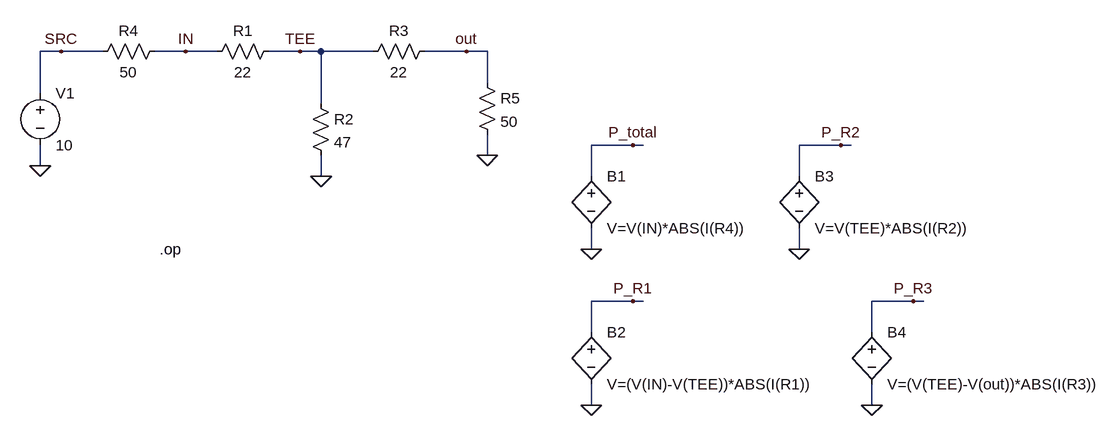
[diagram p0: schematic atten.asc]
atten.asc, the LTspice schematic file:
Version 4
SHEET 1 1524 692
WIRE -112 128 -144 128
WIRE -48 128 -112 128
WIRE 80 128 32 128
WIRE 128 128 80 128
WIRE 256 128 208 128
WIRE 288 128 256 128
WIRE 368 128 288 128
WIRE 512 128 448 128
WIRE 544 128 512 128
WIRE 544 176 544 128
WIRE -144 192 -144 128
WIRE 288 208 288 128
WIRE 768 272 704 272
WIRE 784 272 768 272
WIRE 1088 272 1024 272
WIRE 1104 272 1088 272
WIRE 544 288 544 256
WIRE -144 304 -144 272
WIRE 288 320 288 288
WIRE 704 320 704 272
WIRE 1024 320 1024 272
WIRE 704 432 704 400
WIRE 1024 432 1024 400
WIRE 768 512 704 512
WIRE 784 512 768 512
WIRE 1200 512 1136 512
WIRE 1216 512 1200 512
WIRE 704 560 704 512
WIRE 1136 560 1136 512
WIRE 704 672 704 640
WIRE 1136 672 1136 640
FLAG 256 128 TEE
FLAG 288 320 0
FLAG -144 304 0
FLAG 80 128 IN
FLAG -112 128 SRC
FLAG 544 288 0
FLAG 512 128 out
FLAG 704 432 0
FLAG 768 272 P_total
FLAG 704 672 0
FLAG 768 512 P_R1
FLAG 1024 432 0
FLAG 1088 272 P_R2
FLAG 1136 672 0
FLAG 1200 512 P_R3
SYMBOL res 224 112 R90
WINDOW 0 0 56 VBottom 2
WINDOW 3 32 56 VTop 2
SYMATTR InstName R1
SYMATTR Value 22
SYMBOL res 272 192 R0
SYMATTR InstName R2
SYMATTR Value 47
SYMBOL res 464 112 R90
WINDOW 0 0 56 VBottom 2
WINDOW 3 32 56 VTop 2
SYMATTR InstName R3
SYMATTR Value 22
SYMBOL voltage -144 176 R0
WINDOW 123 0 0 Left 0
WINDOW 39 0 0 Left 0
SYMATTR InstName V1
SYMATTR Value 10
SYMBOL res 48 112 R90
WINDOW 0 0 56 VBottom 2
WINDOW 3 32 56 VTop 2
SYMATTR InstName R4
SYMATTR Value 50
SYMBOL res 528 160 R0
SYMATTR InstName R5
SYMATTR Value 50
SYMBOL bv 704 304 R0
SYMATTR InstName B1
SYMATTR Value V=V(IN)*ABS(I(R4))
SYMBOL bv 704 544 R0
SYMATTR InstName B2
SYMATTR Value V=(V(IN)-V(TEE))*ABS(I(R1))
SYMBOL bv 1024 304 R0
SYMATTR InstName B3
SYMATTR Value V=V(TEE)*ABS(I(R2))
SYMBOL bv 1136 544 R0
SYMATTR InstName B4
SYMATTR Value V=(V(TEE)-V(out))*ABS(I(R3))
TEXT 40 432 Left 2 !.op

The netlist it stands for:
* atten.asc
R1 TEE IN 22
R2 TEE 0 47
R3 out TEE 22
V1 SRC 0 10
R4 IN SRC 50
R5 out 0 50
B1 P_total 0 V=V(IN)*ABS(I(R4))
B2 P_R1 0 V=(V(IN)-V(TEE))*ABS(I(R1))
B3 P_R2 0 V=V(TEE)*ABS(I(R2))
B4 P_R3 0 V=(V(TEE)-V(out))*ABS(I(R3))
.op
.backanno
.end

* Results of the author's LTspice run, read from the files saved beside the schematic
* Operating Point:
*   V(tee) = 2.831 V
*   V(in) = 5.022 V
*   V(out) = 1.966 V
*   V(src) = 10 V
*   V(p_total) = 500 mV
*   V(p_r1) = 218.1 mV
*   V(p_r2) = 170.6 mV
*   V(p_r3) = 34.02 mV
*   I(B4) = 0 A
*   I(B3) = 0 A
*   I(B2) = 0 A
*   I(B1) = 0 A
*   I(R5) = 39.32 mA
*   I(R4) = -99.56 mA
*   I(R3) = -39.32 mA
*   I(R2) = 60.24 mA
*   I(R1) = -99.56 mA
*   I(V1) = -99.56 mA